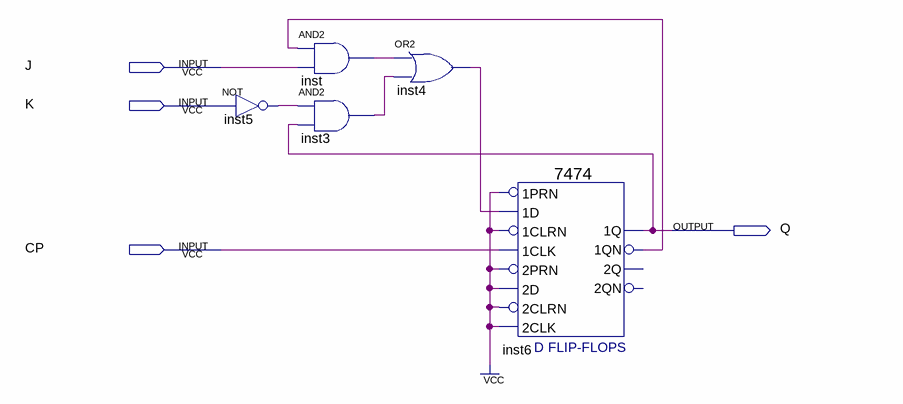
[diagram p0: schematic sheet]
// Quartus schematic Experiment52.bdf as structural Verilog: 5 symbols, 4 pins
module Experiment52 (
  input  J,
  input  K,
  input  CP,
  output Q
);

  wire inst3_out, inst4_out, inst5_out, inst6_1qn, inst_out;

  not inst5 (inst5_out, K);
  and inst (inst_out, inst6_1qn, J);
  and inst3 (inst3_out, inst5_out, Q);
  or inst4 (inst4_out, inst_out, inst3_out);
  \7474  inst6 (
    .\2D (1'b1), .\2PRN (1'b1), .\1CLK (CP), .\1D (inst4_out), .\1PRN (1'b1), .\2CLK (1'b1), .\2CLRN (1'b1),
    .\1CLRN (1'b1), .\1QN (inst6_1qn), .\1Q (Q));  // open: 2Q, 2QN
endmodule
